# Altium schematic sheet Rails.SCHDOC
size A4; DocumentNumber: 5; SheetNumber: 5; SheetTotal: 6
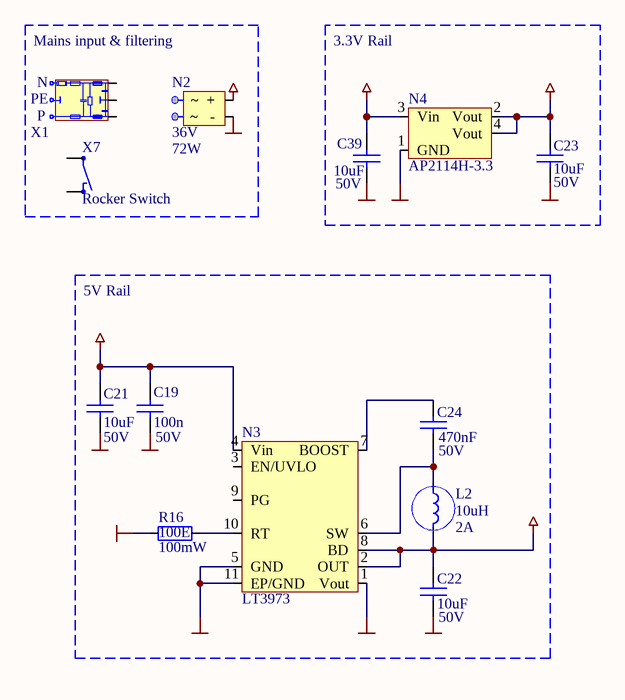
[diagram p0: Rails.SCHDOC]

## Parts
C19  value 100n  Value2: 50V  [SMD_0603]  (hidden comment: C_SMD_CER_100N_50V_10%_X7R_0603)
C21  value 10uF  Value2: 50V  [SMD_1210]  (hidden comment: C_SMD_CER_10U_50V_10%_X7R_1210)
C22  value 10uF  Value2: 50V  [SMD_1210]  (hidden comment: C_SMD_CER_10U_50V_10%_X7R_1210)
C23  value 10uF  Value2: 50V  [SMD_1210]  (hidden comment: C_SMD_CER_10U_50V_10%_X7R_1210)
C24  value 470nF  Value2: 50V  [SMD_0603]  (hidden comment: C_SMD_CER_470N_50V_10%_X7R_0603)
C39  value 10uF  Value2: 50V  [SMD_1210]  (hidden comment: C_SMD_CER_10U_50V_10%_X7R_1210)
L2  value 10uH  Value2: 2A  [SMD_INDUCT_74477710]  (hidden comment: L_SMD_10U_2A_20%_IND_74477710)
N2  value 36V  Value2: 72W  [THT_CON_P2.54_D0.9_1X2]  (hidden comment: N_EXT_ACDC_36V_75W)
N3  Type: LT3973  [SMD_DFN_10_3X3]  (hidden comment: N_LT3973-5_DFN-10)
N4  Type: AP2114H-3.3  [SMD_SOT_22_3]  (hidden comment: N_AP2114H-3.3_SOT223)
R16  value 100E  Value2: 100mW  [SMD_0603]  (hidden comment: R_SMD_THINFILM_100E_0W1_1%_50PPM_0603)
X1  X_POWER_ENTRY_MODULE_W/FILTER_W/FUSE_10A_SMD_CONNECTOR  [SMD_CON_P5.08_W2.0_L5.0_1X3]  (value not drawn)
X7  Type: Rocker Switch  [THT_CON_P5.08_D1.5_1X2]  (hidden comment: X_SWITCH_ROCKER_SPST_6A_250VAC)

## Blocks framed on the sheet
Mains input & filtering: N2 X1 X7
3.3V Rail: C23 C39 N4
5V Rail: C19 C21 C22 C24 L2 N3 R16

## Nets
+3.3V: C23.2 N4.2(Vout) N4.4(Vout)
+5V: C22.2 C39.2 L2.2 N3.2(OUT) N3.8(BD) N4.3(Vin)
+36V: C19.2 C21.2 N2.1(~__+) N3.4(Vin)
GND: C19.1 C21.1 C22.1 C23.1 C39.1 N2.2(~___-) N3.1(Vout) N3.5(GND) N3.11(EP/GND) N4.1(GND) R16.1
NetC24_1: C24.1 L2.1 N3.6(SW)
NetC24_2: C24.2 N3.7(BOOST)
NetN3_10: N3.10(RT) R16.2

Not connected (* = marked no-connect by the designer): N3 3(EN/UVLO) 9(PG); X1 1 2 3; X7 1 2

## Notes on the sheet
- (in symbol X_POWER_ENTRY_MODULE_W/FILTER_W/FUSE_10A_SMD_CONNECTOR) N; PE; P

## Library data of the parts
C19 = C_SMD_CER_100N_50V_10%_X7R_0603: SMD Capacitor; Supplier - E+H-flowtec SAP: 50092748; Supplier - Digikey: 1276-1936-1-ND
C21-C23 C39 = C_SMD_CER_10U_50V_10%_X7R_1210: SMD Ceramic capacitor; Supplier - Digikey: 490-6544-1-ND
L2 = L_SMD_10U_2A_20%_IND_74477710: SMD Inductor; Supplier - Digikey: 732-1200-1-ND; Type: 74477710
N3 = N_LT3973-5_DFN-10-3x3: 42V, 750mA Step-Down Regulator with 2.5uA Quiescent Current and Integrated Diodes; Supplier - Digikey: LT3973EDD-5#PBF-ND
N4 = N_AP2114H-3.3_SOT223: 1A Low Noise CMOS LDO Regulator; Supplier - Digikey: AP2114H-3.3TRG1DICT-ND
R16 = R_SMD_THINFILM_100E_0W1_1%_50PPM_0603: SMD Resistor; Supplier - E+H-flowtec SAP: 50092674; Supplier - Digikey: YAG2128CT-ND
X1 = X_POWER_ENTRY_MODULE_W/FILTER_W/FUSE_10A_SMD_CONNECTOR: MOD POWER ENTRY INLET WITH FUSE 10A; Supplier - Digikey: 817-1489-ND
C24 = C_SMD_CER_470N_50V_10%_X7R_0603: Supplier - Digikey: 587-3170-1-ND
N2 = N_EXT_ACDC_36V_75W: Supplier - Digikey: 285-1829-ND
X7 = X_SWITCH_ROCKER_SPST_6A_250VAC: Supplier - Digikey: 360-1721-ND